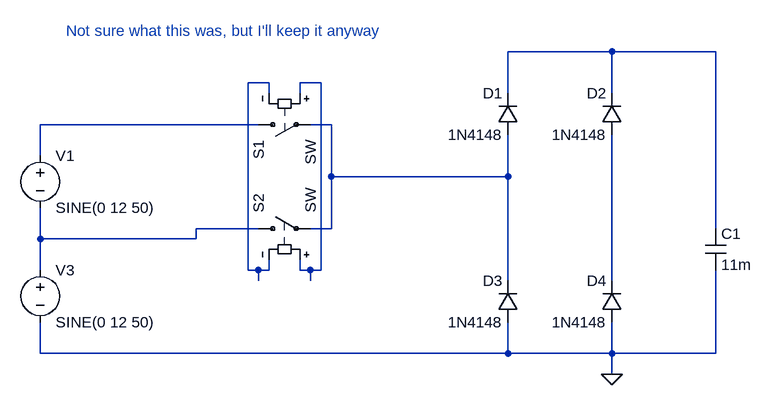
[diagram p0: schematic Draft1.asc]
Draft1.asc, the LTspice schematic file:
Version 4
SHEET 1 1064 680
WIRE 832 -160 672 -160
WIRE 992 -160 832 -160
WIRE 304 -112 272 -112
WIRE 384 -112 352 -112
WIRE 304 -96 304 -112
WIRE 352 -96 352 -112
WIRE 672 -96 672 -160
WIRE 832 -96 832 -160
WIRE 288 -48 -48 -48
WIRE 400 -48 368 -48
WIRE -48 0 -48 -48
WIRE 400 32 400 -48
WIRE 672 32 672 -32
WIRE 672 32 400 32
WIRE 288 112 192 112
WIRE 400 112 400 32
WIRE 400 112 368 112
WIRE 992 112 992 -160
WIRE -48 128 -48 80
WIRE 192 128 192 112
WIRE 192 128 -48 128
WIRE -48 176 -48 128
WIRE 272 176 272 -112
WIRE 288 176 272 176
WIRE 304 176 304 160
WIRE 304 176 288 176
WIRE 352 176 352 160
WIRE 368 176 352 176
WIRE 384 176 384 -112
WIRE 384 176 368 176
WIRE 288 192 288 176
WIRE 368 192 368 176
WIRE 672 192 672 32
WIRE 832 192 832 -32
WIRE -48 304 -48 256
WIRE 672 304 672 256
WIRE 672 304 -48 304
WIRE 832 304 832 256
WIRE 832 304 672 304
WIRE 992 304 992 176
WIRE 992 304 832 304
WIRE 832 336 832 304
FLAG 832 336 0
SYMBOL voltage -48 -16 R0
WINDOW 123 0 0 Left 0
WINDOW 39 0 0 Left 0
SYMATTR InstName V1
SYMATTR Value SINE(0 12 50)
SYMBOL voltage -48 160 R0
WINDOW 123 0 0 Left 0
WINDOW 39 0 0 Left 0
SYMATTR InstName V3
SYMATTR Value SINE(0 12 50)
SYMBOL sw 272 -48 M90
SYMATTR InstName S1
SYMBOL sw 272 112 R270
SYMATTR InstName S2
SYMBOL diode 688 -32 R180
WINDOW 0 24 64 Left 2
WINDOW 3 24 0 Left 2
SYMATTR InstName D1
SYMATTR Value 1N4148
SYMBOL diode 848 -32 R180
WINDOW 0 24 64 Left 2
WINDOW 3 24 0 Left 2
SYMATTR InstName D2
SYMATTR Value 1N4148
SYMBOL diode 688 256 R180
WINDOW 0 24 64 Left 2
WINDOW 3 24 0 Left 2
SYMATTR InstName D3
SYMATTR Value 1N4148
SYMBOL diode 848 256 R180
WINDOW 0 24 64 Left 2
WINDOW 3 24 0 Left 2
SYMATTR InstName D4
SYMATTR Value 1N4148
SYMBOL cap 976 112 R0
SYMATTR InstName C1
SYMATTR Value 11m
TEXT -8 -192 Left 2 ;Not sure what this was, but I'll keep it anyway

The netlist it stands for:
* Draft1.asc
V1 N004 N006 SINE(0 12 50)
V3 N006 0 SINE(0 12 50)
S1 N004 N005 N003 N002 SW
S2 N006 N005 N003 N002 SW
D1 N005 N001 1N4148
D2 N007 N001 1N4148
D3 0 N005 1N4148
D4 0 N007 1N4148
C1 N001 0 11m
.model D D
.lib standard.dio
* Not sure what this was, but I'll keep it anyway
.backanno
.end